# EAGLE design MAX31865 (EAGLE 8.5.2)
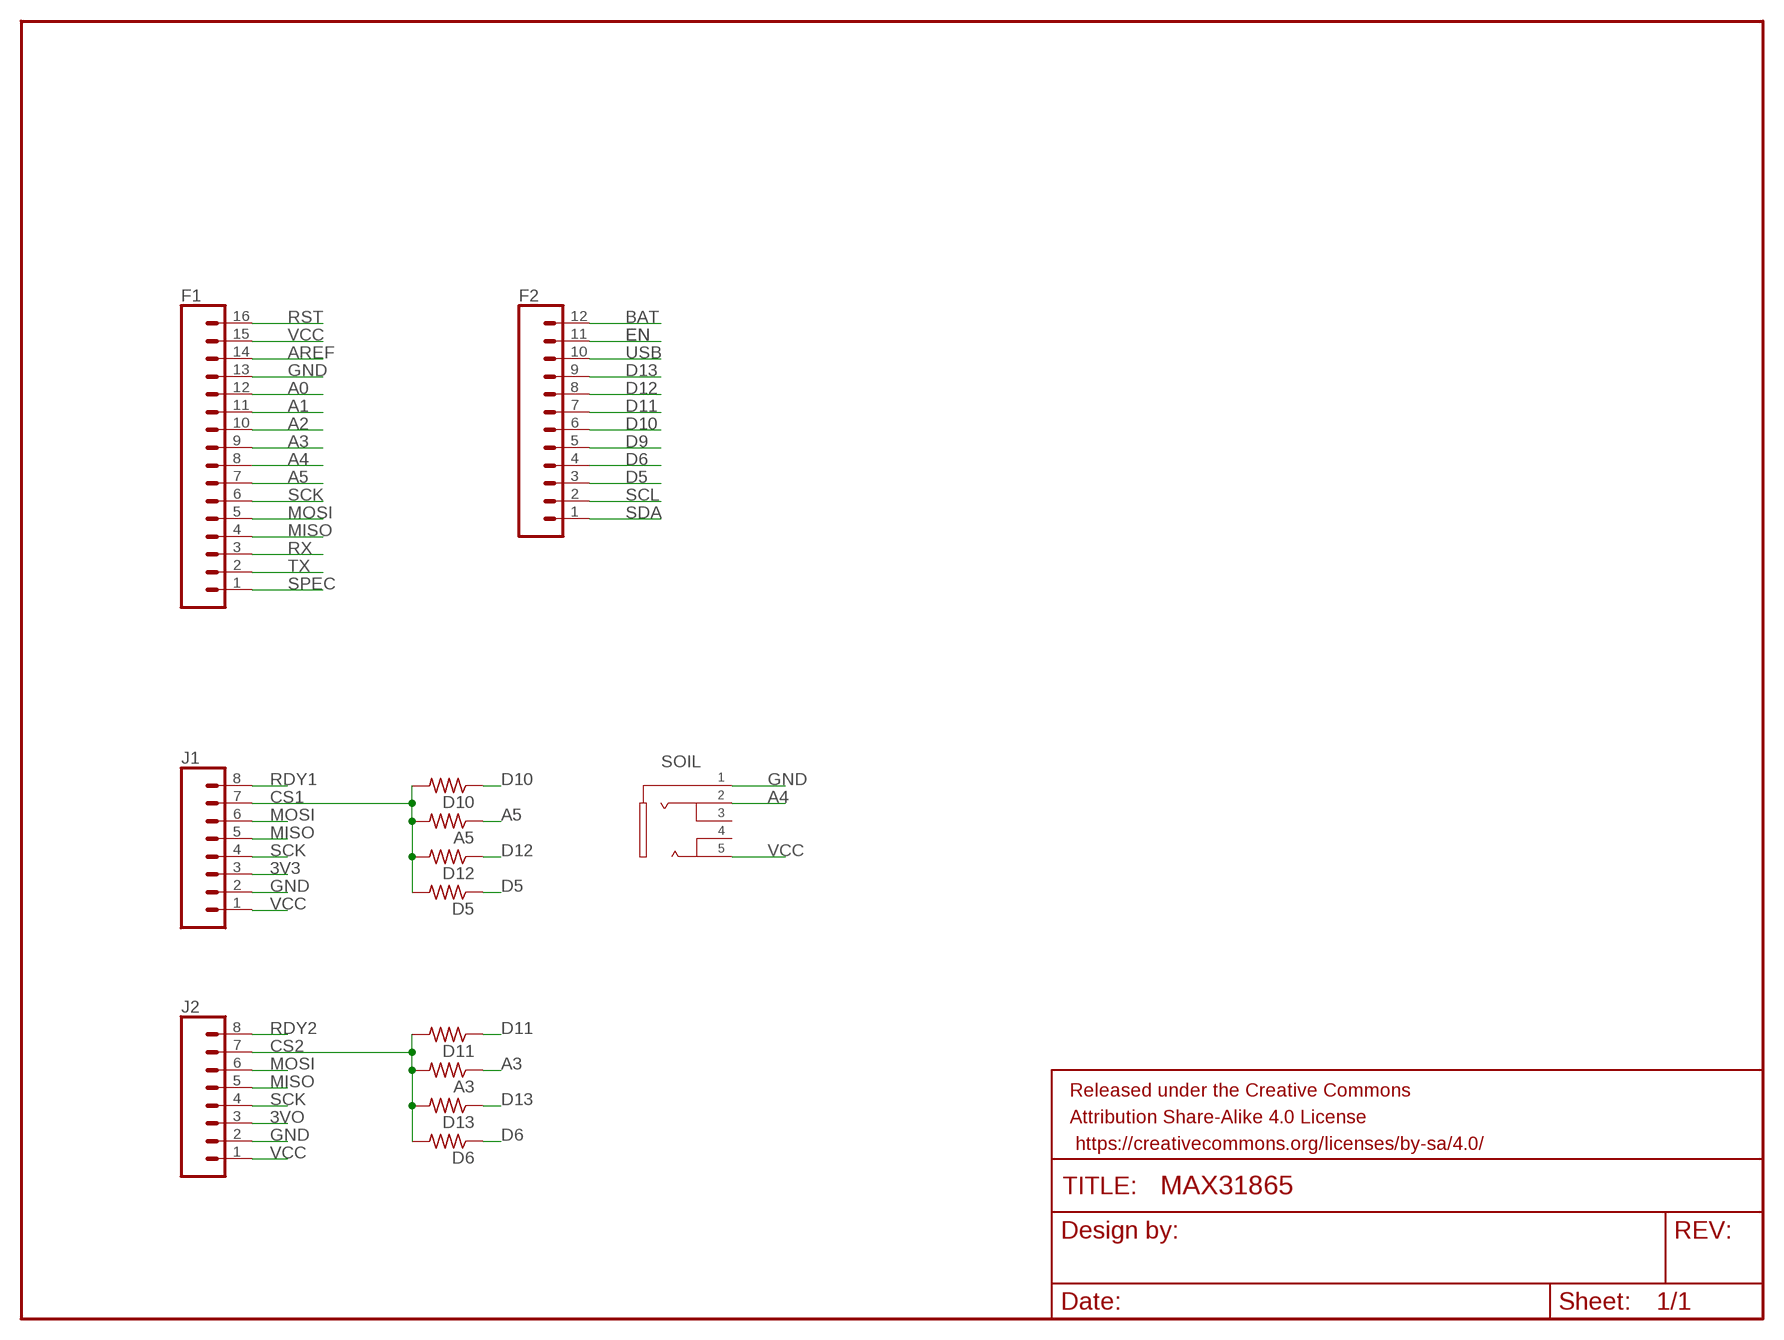
[diagram p0: schematic, sheet 1]

## Parts
A3  R-US_R0603  [R0603]
A5  R-US_R0603  [R0603]
D5  R-US_R0603  [R0603]
D6  R-US_R0603  [R0603]
D10  R-US_R0603  [R0603]
D11  R-US_R0603  [R0603]
D12  R-US_R0603  [R0603]
D13  R-US_R0603  [R0603]
F1  CONN_16  [1X16]
F2  CONN_12  [1X12]
FRAME1  FRAME-LETTER  [CREATIVE_COMMONS]
J1  CONN_08"  [1X08]
J2  CONN_08"  [1X08]
SOIL  JW-PJ-307-5H  [JW-PJ-307-5H]

## Nets
3V3: J1.3
3VO: J2.3
A0: F1.12
A1: F1.11
A2: F1.10
A3: A3.1 F1.9
A4: F1.8 SOIL.2
A5: A5.1 F1.7
AREF: F1.14
BAT: F2.12
CS1: A5.2 D5.2 D10.2 D12.2 J1.7
CS2: A3.2 D6.2 D11.2 D13.2 J2.7
D5: D5.1 F2.3
D6: D6.1 F2.4
D9: F2.5
D10: D10.1 F2.6
D11: D11.1 F2.7
D12: D12.1 F2.8
D13: D13.1 F2.9
EN: F2.11
GND: F1.13 J1.2 J2.2 SOIL.1
MISO: F1.4 J1.5 J2.5
MOSI: F1.5 J1.6 J2.6
RDY1: J1.8
RDY2: J2.8
RST: F1.16
RX: F1.3
SCK: F1.6 J1.4 J2.4
SCL: F2.2
SDA: F2.1
SPEC: F1.1
TX: F1.2
USB: F2.10
VCC: F1.15 J1.1 J2.1 SOIL.5
Unconnected: SOIL.3 SOIL.4

## Library data of the parts
A3 A5 D5 D6 D10-D13 = rcl:R-US_: RESISTOR, American symbol; SPICEPREFIX: R
F1 = SparkFun-Connectors:CONN_16: Multi connection point. Often used as Generic Header-pin footprint for 0.1 inch spaced/style header connections On any of the 0.1 inch spaced packages, you can populate with these: Break Away Headers - Straight <https://www.sparkfun.com/products/116> (PRT-00116) Break Away Male Headers - Right Angle <https://www.sparkfun.com/products/553> (PRT-00553) Female Headers <https://www.sparkfun.com/products/115> (PRT-00115) Break Away Headers - Machine Pin <https://www.sparkfun.com/products/117> (PRT-00117) Break Away Female Headers - Swiss Machine Pin <https://www.sparkfun.com/products/743> (PRT-00743) For SCREWTERMINALS and SPRING TERMINALS visit here: Screw Terimnals on SparkFun.com <https://www.sparkfun.com/search/results?term=Screw+Terminals> (5mm/3.5mm/2.54mm spacing) This device is also useful as a general connection point to wire up your design to another part of your project. Our various solder wires solder well into these plated through hole pads. Hook-Up Wire - Assortment (Stranded, 22 AWG) <https://www.sparkfun.com/products/11375> (PRT-11375) Hook-Up Wire - Assortment (Solid Core, 22 AWG) <https://www.sparkfun.com/products/11367> (PRT-11367) View the entire wire category on our website here <https://www.sparkfun.com/categories/141> Special notes: Molex polarized connector foot print use with SKU : PRT-08231 with associated crimp pins and housings. 1MM SMD Version SKU: PRT-10208 NOTES ON THE VARIANTS LOCK and LOCK_LONGPADS... This footprint was designed to help hold the alignment of a through-hole component (i.e. 6-pin header) while soldering it into place. You may notice that each hole has been shifted either up or down by 0.005 of an inch from it's more standard position (which is a perfectly straight line). This slight alteration caused the pins (the squares in the middle) to touch the edges of the holes. Because they are alternating, it causes a "brace" to hold the component in place. 0.005 has proven to be the perfect amount of "off-center" position when using our standard breakaway headers. Although looks a little odd when you look at the bare footprint, once you have a header in there, the alteration is very hard to notice. Also,if you push a header all the way into place, it is covered up entirely on the bottom side.
F2 = SparkFun-Connectors:CONN_12: Multi connection point. Often used as Generic Header-pin footprint for 0.1 inch spaced/style header connections On any of the 0.1 inch spaced packages, you can populate with these: Break Away Headers - Straight <https://www.sparkfun.com/products/116> (PRT-00116) Break Away Male Headers - Right Angle <https://www.sparkfun.com/products/553> (PRT-00553) Female Headers <https://www.sparkfun.com/products/115> (PRT-00115) Break Away Headers - Machine Pin <https://www.sparkfun.com/products/117> (PRT-00117) Break Away Female Headers - Swiss Machine Pin <https://www.sparkfun.com/products/743> (PRT-00743) For SCREWTERMINALS and SPRING TERMINALS visit here: Screw Terimnals on SparkFun.com <https://www.sparkfun.com/search/results?term=Screw+Terminals> (5mm/3.5mm/2.54mm spacing) This device is also useful as a general connection point to wire up your design to another part of your project. Our various solder wires solder well into these plated through hole pads. Hook-Up Wire - Assortment (Stranded, 22 AWG) <https://www.sparkfun.com/products/11375> (PRT-11375) Hook-Up Wire - Assortment (Solid Core, 22 AWG) <https://www.sparkfun.com/products/11367> (PRT-11367) View the entire wire category on our website here <https://www.sparkfun.com/categories/141> Special notes: Molex polarized connector foot print use with SKU : PRT-08231 with associated crimp pins and housings. 1MM SMD Version SKU: PRT-10208 NOTES ON THE VARIANTS LOCK and LOCK_LONGPADS... This footprint was designed to help hold the alignment of a through-hole component (i.e. 6-pin header) while soldering it into place. You may notice that each hole has been shifted either up or down by 0.005 of an inch from it's more standard position (which is a perfectly straight line). This slight alteration caused the pins (the squares in the middle) to touch the edges of the holes. Because they are alternating, it causes a "brace" to hold the component in place. 0.005 has proven to be the perfect amount of "off-center" position when using our standard breakaway headers. Although looks a little odd when you look at the bare footprint, once you have a header in there, the alteration is very hard to notice. Also,if you push a header all the way into place, it is covered up entirely on the bottom side.
FRAME1 = SparkFun-Aesthetics:FRAME-LETTER: Schematic Frame - Letter Standard 8.5x11 US Letter frame
J1 J2 = SparkFun-Connectors:CONN_08: Multi connection point. Often used as Generic Header-pin footprint for 0.1 inch spaced/style header connections On any of the 0.1 inch spaced packages, you can populate with these: Break Away Headers - Straight <https://www.sparkfun.com/products/116> (PRT-00116) Break Away Male Headers - Right Angle <https://www.sparkfun.com/products/553> (PRT-00553) Female Headers <https://www.sparkfun.com/products/115> (PRT-00115) Break Away Headers - Machine Pin <https://www.sparkfun.com/products/117> (PRT-00117) Break Away Female Headers - Swiss Machine Pin <https://www.sparkfun.com/products/743> (PRT-00743) Arduino Stackable Header - 8 Pin <https://www.sparkfun.com/products/9279> (PRT-09279) For SCREWTERMINALS and SPRING TERMINALS visit here: Screw Terimnals on SparkFun.com <https://www.sparkfun.com/search/results?term=Screw+Terminals> (5mm/3.5mm/2.54mm spacing) This device is also useful as a general connection point to wire up your design to another part of your project. Our various solder wires solder well into these plated through hole pads. Hook-Up Wire - Assortment (Stranded, 22 AWG) <https://www.sparkfun.com/products/11375> (PRT-11375) Hook-Up Wire - Assortment (Solid Core, 22 AWG) <https://www.sparkfun.com/products/11367> (PRT-11367) View the entire wire category on our website here <https://www.sparkfun.com/categories/141> Special notes: Molex polarized connector foot print use with SKU : PRT-08231 with associated crimp pins and housings. 1MM SMD Version SKU: PRT-10208 NOTES ON THE VARIANTS LOCK and LOCK_LONGPADS... This footprint was designed to help hold the alignment of a through-hole component (i.e. 6-pin header) while soldering it into place. You may notice that each hole has been shifted either up or down by 0.005 of an inch from it's more standard position (which is a perfectly straight line). This slight alteration caused the pins (the squares in the middle) to touch the edges of the holes. Because they are alternating, it causes a "brace" to hold the component in place. 0.005 has proven to be the perfect amount of "off-center" position when using our standard breakaway headers. Although looks a little odd when you look at the bare footprint, once you have a header in there, the alteration is very hard to notice. Also,if you push a header all the way into place, it is covered up entirely on the bottom side.; PROD_ID: CONN-08438
SOIL = jack:JW-PJ-307-5

## Net classes
0 default: width 0.254 mm, clearance 0.205 mm
1 GND: width 0.61 mm

## Board
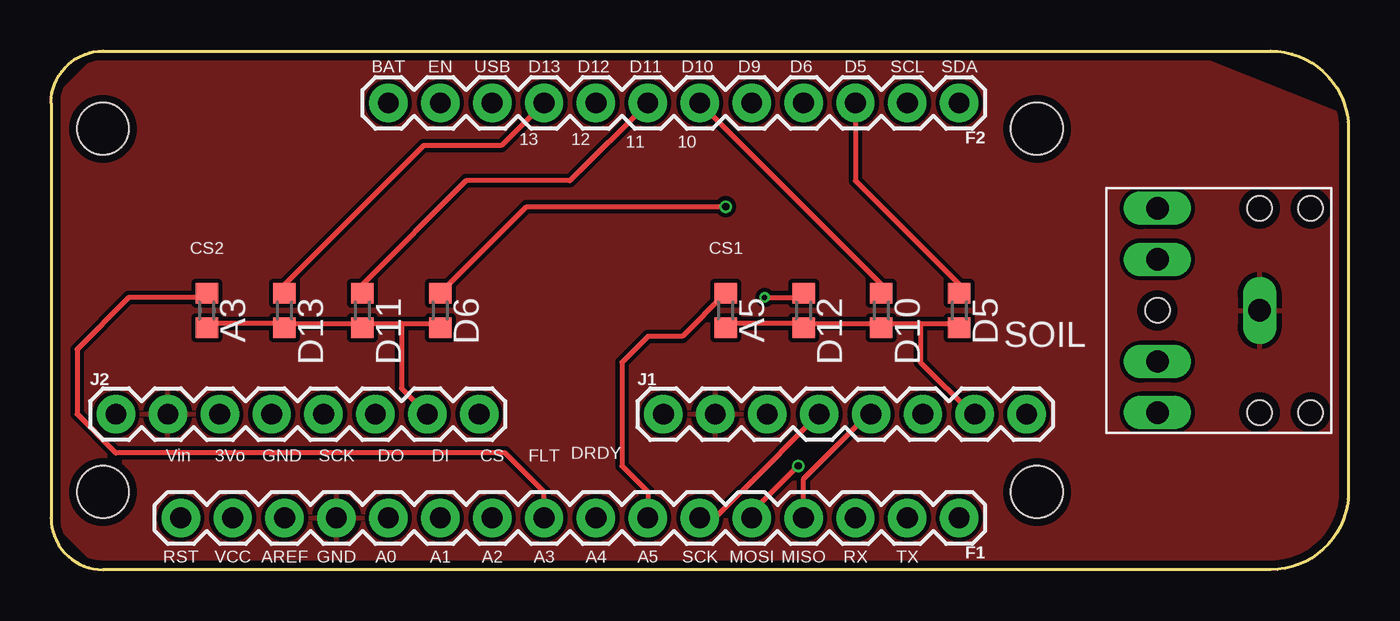
[diagram p1: board, top side]
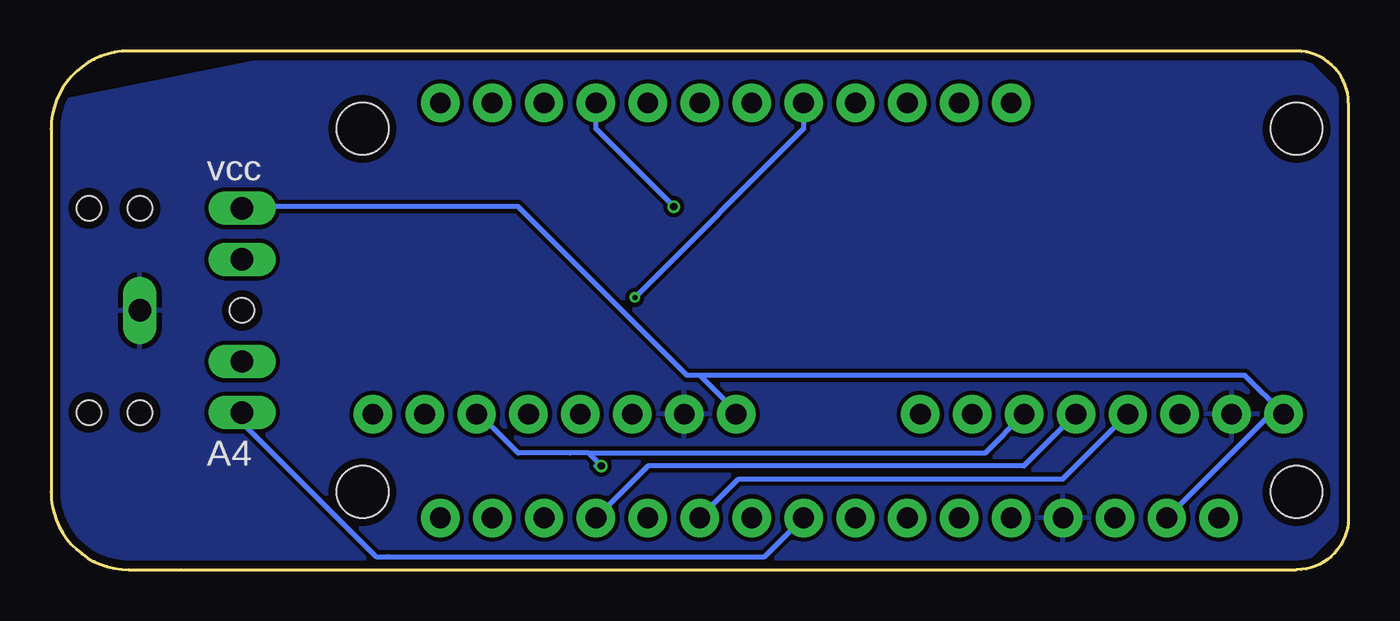
[diagram p2: board, bottom side, seen from below]

Size 63.5 x 25.4 mm. Coordinates in mm from the lower left corner, seen from the top.
Outline: 0,22.86 0,2.54 arc90 2.54,0 57.15,0 59.69,0 arc90 63.5,3.81 63.5,21.59 arc90 59.69,25.4 2.54,25.4 arc90 0,22.86
Copper layers (1*16): Top 0.035559375mm / dielectric 1.6mm / Bottom 0.035559375mm
Design rules "oshpark-2layer": minimum track width 6mil, minimum drill 10mil, track to track 6mil, track to pad 6mil, pad to pad 6mil, via to via 6mil, smd to smd 6mil, copper to edge 15mil, drill to drill 6mil, minimum pad ring 5mil, minimum via ring 5mil, stop-mask expansion 2.5mil, vias tented up to drill 0mil, thermal gap 10mil
Holes 2.54 mm at 48.26,3.81 48.26,21.59 2.54,3.81 2.54,21.59

### Footprints (pad centres in the part's own frame; a part is rotated, then mirrored left to right if it is on the bottom)
R0603 = smd 1 x 1.1: 1 -0.85,0; 2 0.85,0
1X16 = drill 1.016 pad 1.88: 1 0,0; 2 2.54,0; 3 5.08,0; 4 7.62,0; 5 10.16,0; 6 12.7,0; 7 15.24,0; 8 17.78,0; 9 20.32,0; 10 22.86,0; 11 25.4,0; 12 27.94,0; 13 30.48,0; 14 33.02,0; 15 35.56,0; 16 38.1,0
1X12 = drill 1.016 pad 1.88: 1 0,0; 2 2.54,0; 3 5.08,0; 4 7.62,0; 5 10.16,0; 6 12.7,0; 7 15.24,0; 8 17.78,0; 9 20.32,0; 10 22.86,0; 11 25.4,0; 12 27.94,0
1X08 = drill 1.016 pad 1.88: 1 0,0; 2 2.54,0; 3 5.08,0; 4 7.62,0; 5 10.16,0; 6 12.7,0; 7 15.24,0; 8 17.78,0
JW-PJ-307-5H = drill 1.1 long: 1 -2,0; 2 3,5; 3 3,2.5; 4 3,-2.5; 5 3,-5 | hole 1.2: -4.5,5; -2,5; 3,0; -4.5,-5; -2,-5

### Placement (x,y rotation side)
A3  7.62,12.7 270 top
A5  33.02,12.7 270 top
D5  44.45,12.7 270 top
D6  19.05,12.7 270 top
D10  40.64,12.7 270 top
D11  15.24,12.7 270 top
D12  36.83,12.7 270 top
D13  11.43,12.7 270 top
F1  44.45,2.54 180 top
F2  44.45,22.86 180 top
FRAME1  -88.9,1.27 0 top  (outside the outline)
J1  29.97,7.62 0 top
J2  3.17,7.62 0 top
SOIL  57.15,12.7 180 top

### Tracks (layer width: path | path; a pad name or v marks a point on that pad's centre or on a via)
A3
  Top 0.254: F1.9 24.13,3.81 22.22,5.71 3.17,5.71 1.27,7.62 1.27,10.79 3.81,13.34 7.41,13.34 A3.1
A4
  Bottom 0.254: SOIL.2 54.15,7.19 47.6,0.64 46.99,0.64 28.58,0.64 F1.8
A5
  Top 0.254: F1.7 29.21,3.81 27.94,5.08 27.94,10.16 29.21,11.43 30.9,11.43 A5.1
CS1
  Top 0.254: 36.83,12.06 33.02,12.06 A5.2 | 36.83,12.06 40.64,12.06 | 36.83,12.06 D12.2 | 40.64,12.06 42.55,12.06 | 42.55,12.06 44.45,12.06 D5.2 | 40.64,12.06 D10.2 | 42.55,12.06 42.55,10.16 45.09,7.62 J1.7
CS2
  Top 0.254: 11.43,12.06 7.62,12.06 A3.2 | 11.43,12.06 15.24,12.06 | 11.43,12.06 D13.2 | 15.24,12.06 17.14,12.06 | 17.14,12.06 19.05,12.06 D6.2 | 15.24,12.06 D11.2 | J2.7 17.14,8.89 17.14,12.06
D5
  Top 0.254: F2.3 39.37,19.05 44.45,13.97 D5.1
D6  (via drill 0.35)
  Top 0.254: D6.1 23.28,17.78 v33.02,17.78
  Bottom 0.254: v33.02,17.78 36.83,21.59 F2.4
D10
  Top 0.254: F2.6 31.75,22.23 32.38,22.23 40.64,13.97 D10.1
D11
  Top 0.254: D11.1 15.24,13.97 20.32,19.05 25.4,19.05 F2.7
D12  (via drill 0.25)
  Top 0.254: v34.92,13.34 36.83,13.34 D12.1
  Bottom 0.254: v34.92,13.34 26.67,21.59 F2.8
D13
  Top 0.254: D13.1 11.43,13.97 18.24,20.78 22.05,20.78 F2.9
GND
  pour Top: 0,22.86 0,2.54 2.54,0 50.8,-0.25 63.5,-0.25 64.77,21.59 52.07,26.67 2.54,25.4
  pour Bottom: 0,22.86 0,2.54 2.54,0 52.07,-1.27 64.77,1.27 63.5,22.86 50.8,25.4 2.54,25.4
MISO
  Top 0.254: F1.4 36.83,4.45 40.01,7.62 J1.5
  Bottom 0.254: J2.5 15.88,5.08 34.29,5.08 F1.4
MOSI  (via drill 0.35)
  Top 0.254: v36.57,5.08 34.29,2.8 F1.5
  Bottom 0.254: J2.6 17.78,5.71 37.2,5.71 | J1.6 42.55,7.62 40.64,5.71 38.1,5.71 37.2,5.71 | 36.83,5.08 v36.57,5.08 37.2,5.71
SCK
  Top 0.254: J1.4 33.78,3.81 33.76,3.81 32.49,2.54 F1.6
  Bottom 0.254: J2.4 13.97,4.45 29.84,4.45 31.12,3.17 31.12,2.54 F1.6
VCC
  Bottom 0.254: 31.75,9.53 32.38,9.53 40.64,17.78 53.98,17.78 SOIL.5 | 31.75,9.53 29.84,7.62 J1.1 | 31.75,9.53 5.08,9.53 J2.1 3.81,7.62 F1.15

### Text on the board
tPlace: BAT | EN | USB | D13 | D12 | D11 | D10 | D9 | D6 | D5 | SCL | SDA | 13 | 12 | 11 | 10 | CS2 | CS1 | Vin | 3Vo | GND | SCK | DO | DI | CS | FLT | DRDY | RST | VCC | AREF | GND | A0 | A1 | A2 | A3 | A4 | A5 | SCK | MOSI | MISO | RX | TX
bNames: vcc | A4